# EasyEDA schematic System Schem_2020-06-05_15-55-24.json
REV: 1.0; Date: 2020-06-04; Sheet: 1/1; Drawn By: jasonandrea14
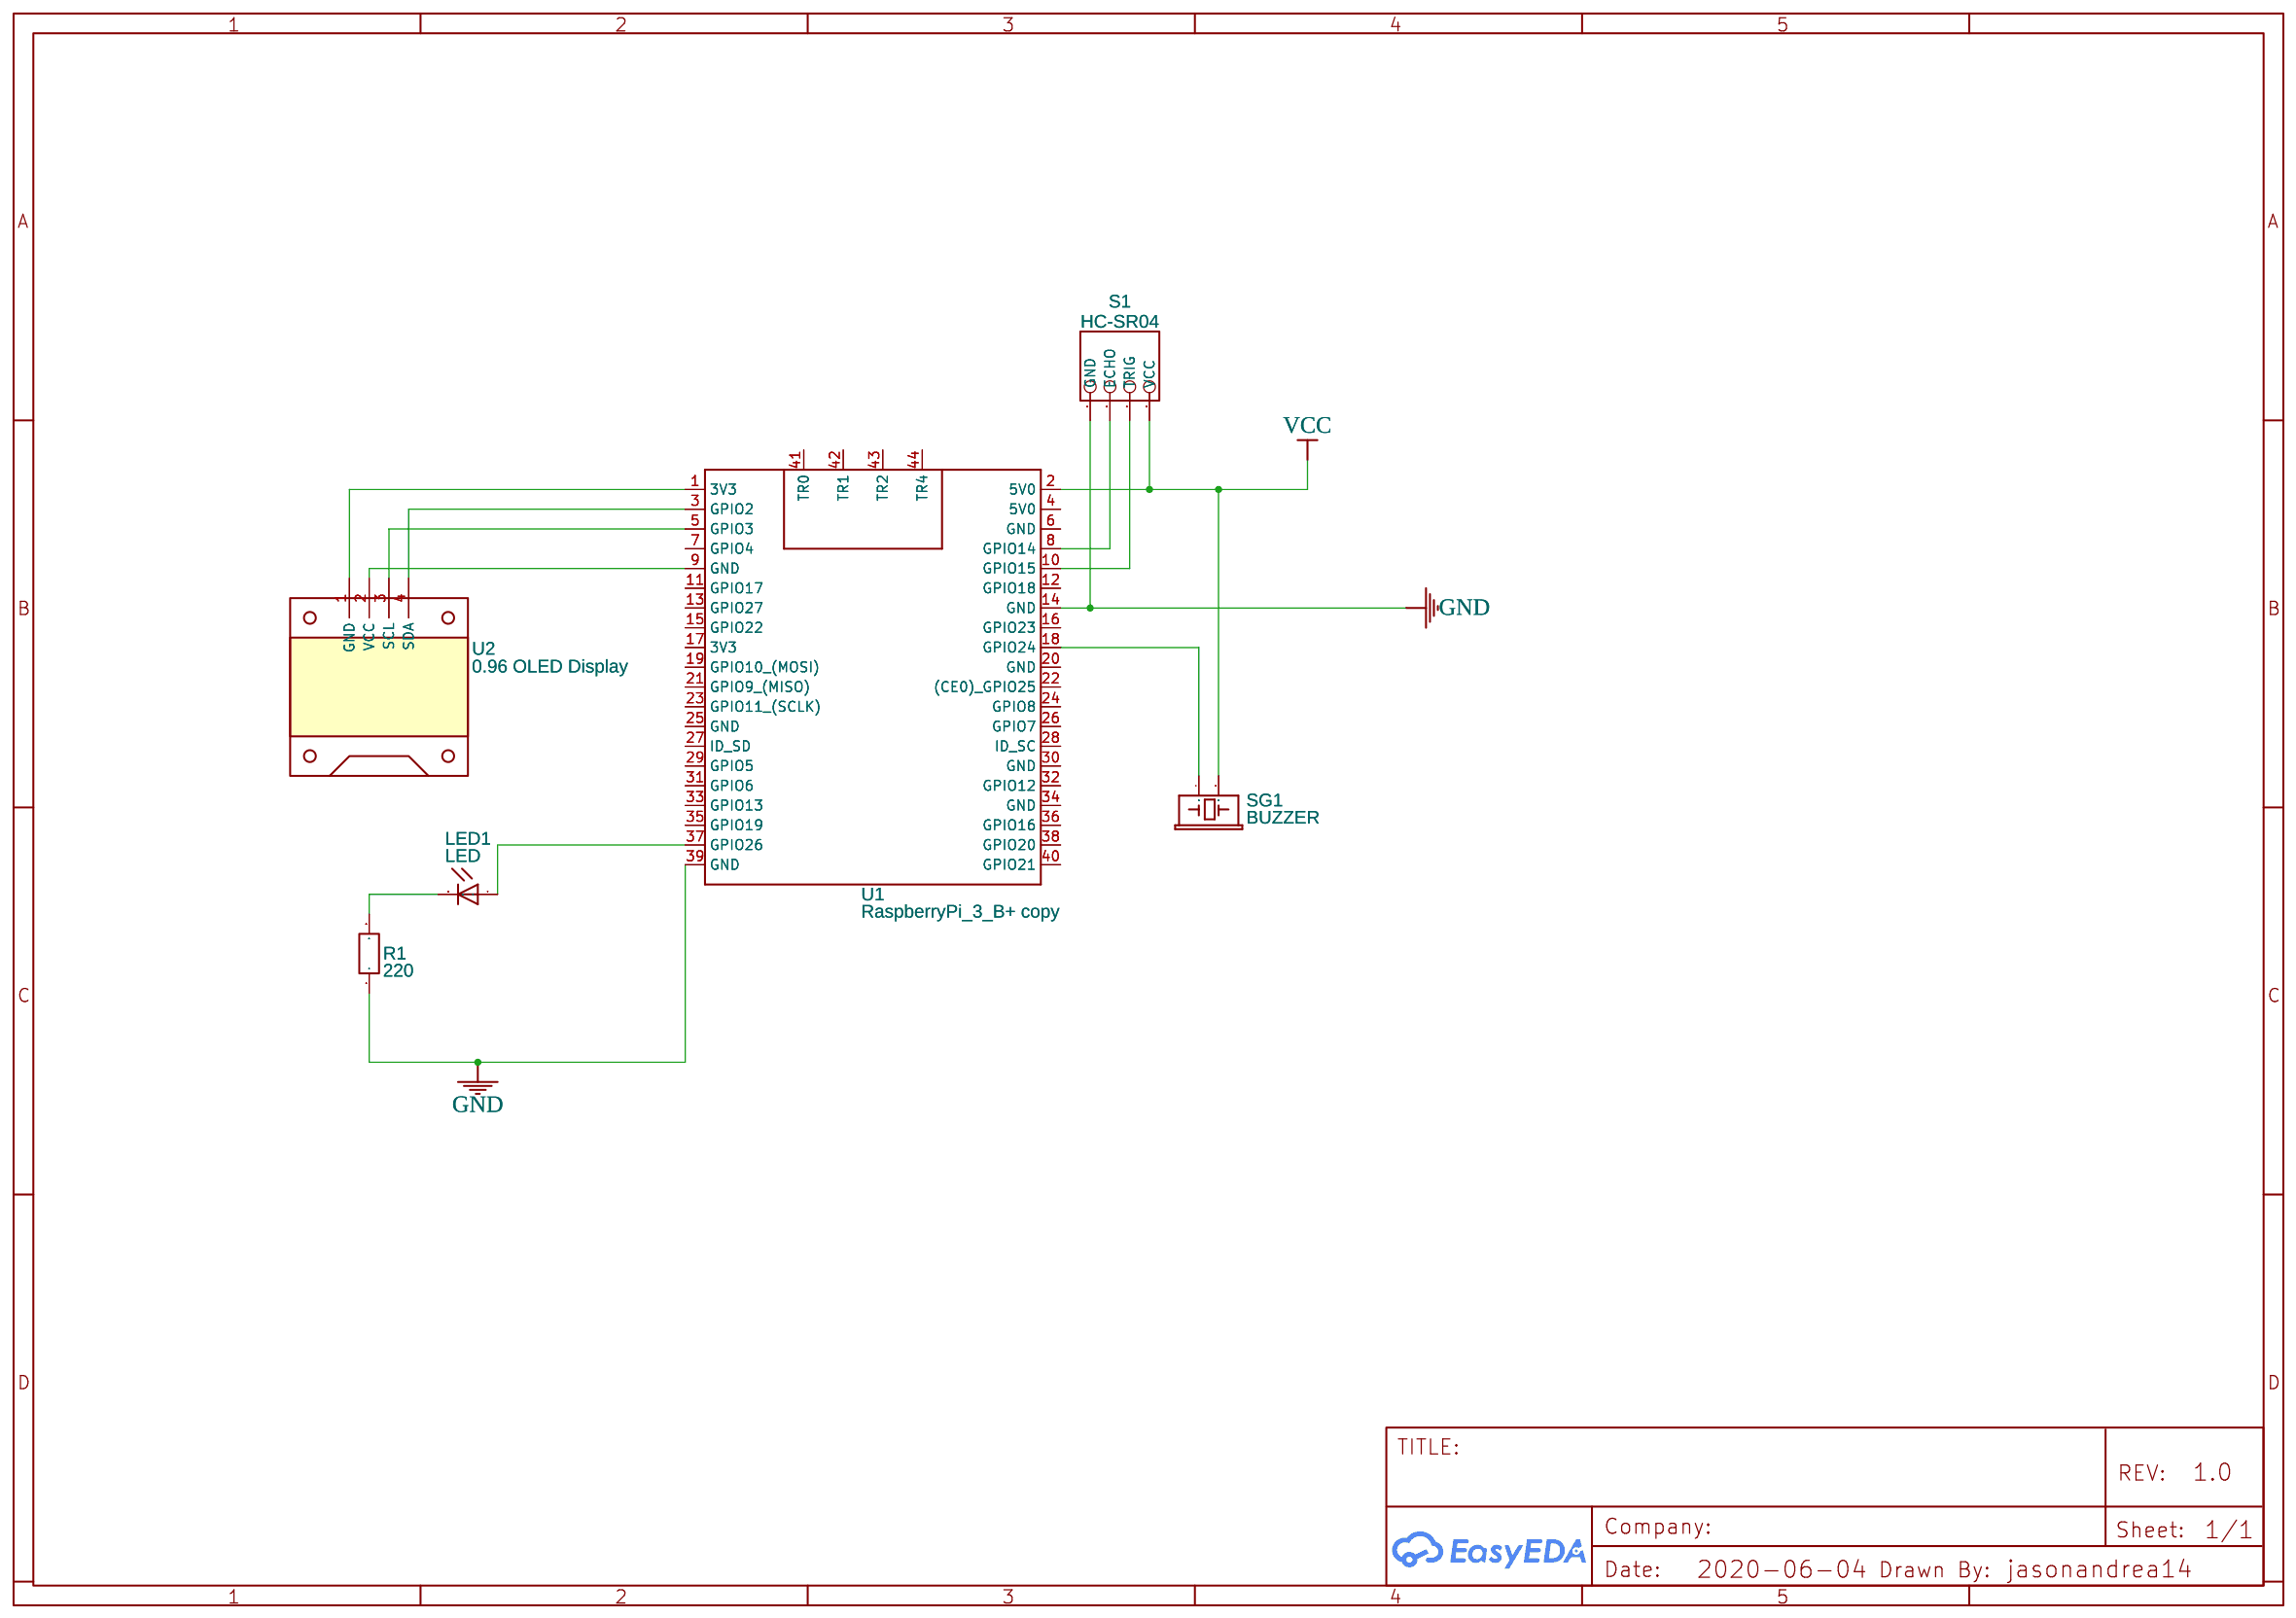
[diagram p0: schematic sheet]

## Parts
LED1  LED  [CHIPLED_0805]
R1  220  [R0201]
S1  HC-SR04  [HC-SR04]
SG1  BUZZER  [BUZZER-12MM-NS-KIT]
U1  RaspberryPi_3_B+ copy  [RASBERRYPI_3_B+_POE]
U2  0.96 OLED Display  [0.96 OLED DISPLAY]

## Library data of the parts
LED1 = LED: Contributor: Adafruit
R1 = R_0201_EU: Contributor: LCEDA_Lib
S1 = HC-SR04: Contributor: gomezramones
SG1 = BUZZER: Contributor: SparkFun
U1 = RaspberryPi_3_B+ copy: Manufacturer Part: RaspberryPi 3; Contributor: May011986
U2 = 0.96 OLED Display: Manufacturer Part: 0.96 OLED; Contributor: Gaetano Messina

## Nets
GND: R1.1 S1.4(GND) U1.14(GND) U1.39(GND)
VCC: S1.1(VCC) SG1.+(1) U1.2(5V0)
Net-(LED1-A): LED1.A U1.37(GPIO26)
Net-(LED1-C): LED1.C R1.2
Net-(S1-2): S1.2(TRIG) U1.10(GPIO15)
Net-(S1-3): S1.3(ECHO) U1.8(GPIO14)
Net-(SG1--): SG1.-(2) U1.18(GPIO24)
Net-(U1-1): U1.1(3V3) U2.1(GND)
Net-(U1-3): U1.3(GPIO2) U2.4(SDA)
Net-(U1-5): U1.5(GPIO3) U2.3(SCL)
Net-(U1-9): U1.9(GND) U2.2(VCC)

Not connected (* = marked no-connect by the designer): U1 4(5V0) 6(GND) 7(GPIO4) 11(GPIO17) 12(GPIO18) 13(GPIO27) 15(GPIO22) 16(GPIO23) 17(3V3) 19(GPIO10 (MOSI)) 20(GND) 21(GPIO9 (MISO)) 22((CE0) GPIO25) 23(GPIO11 (SCLK)) 24(GPIO8) 25(GND) 26(GPIO7) 27(ID_SD) 28(ID_SC) 29(GPIO5) 30(GND) 31(GPIO6) 32(GPIO12) 33(GPIO13) 34(GND) 35(GPIO19) 36(GPIO16) 38(GPIO20) 40(GPIO21) 41(TR0) 42(TR1) 43(TR2) 44(TR4)
